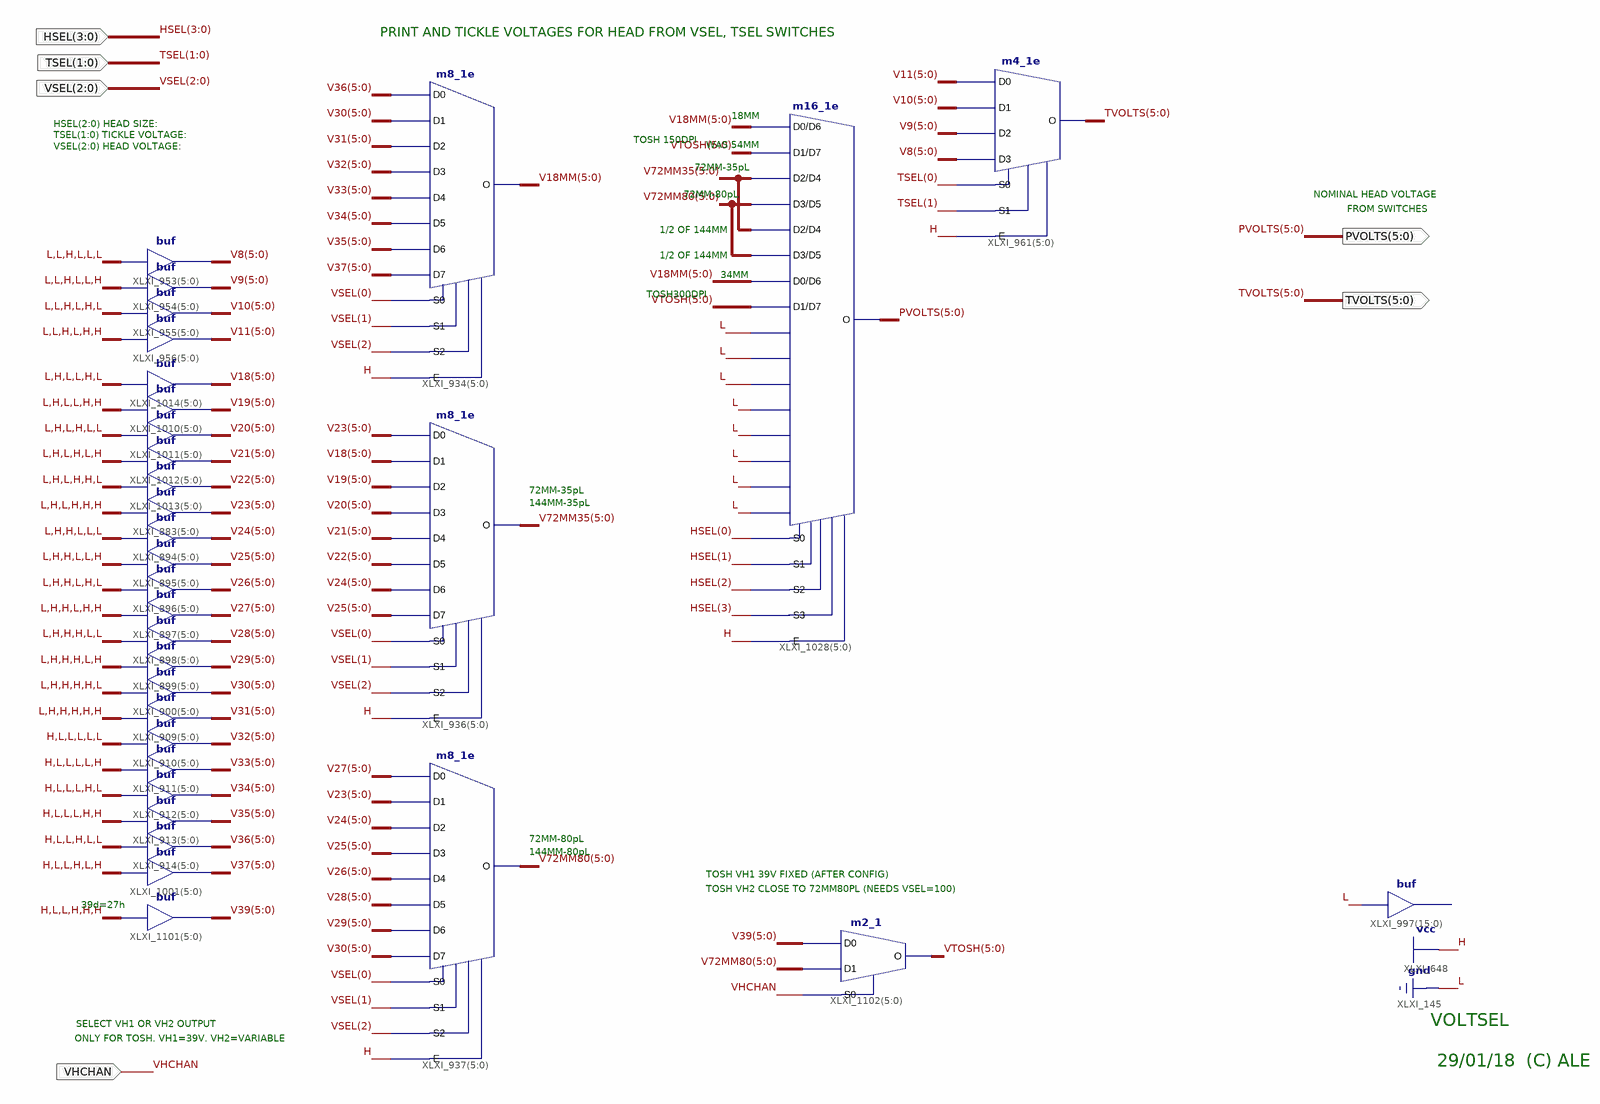
[diagram p0: schematic sheet 1]
// Xilinx ISE schematic DB_VoltSel.sch (spartan3e) as structural Verilog: 32 symbols, 6 ports
module DB_VoltSel (
  input  [3:0] HSEL,
  input  [2:0] VSEL,
  input  [1:0] TSEL,
  input  VHCHAN,
  output [5:0] TVOLTS,
  output [5:0] PVOLTS
);

  wire [5:0] V8, V9, V10, V11, V18, V18MM, V19, V20, V21, V22, V23, V24, V25, V26, V27, V28, V29, V30, V31,
       V32, V33, V34, V35, V36, V37, V39, V72MM35, V72MM80, VTOSH;

  // buf XLXI_997[15..0] has open pins: I=1'b0, O=open
  m8_1e XLXI_934[5:0] (
    .D0(V36), .D1(V30), .D2(V31), .D3(V32), .D4(V33), .D5(V34), .D6(V35), .D7(V37), .E(1'b1), .S0(VSEL[0]),
    .S1(VSEL[1]), .S2(VSEL[2]), .O(V18MM));
  m8_1e XLXI_936[5:0] (
    .D0(V23), .D1(V18), .D2(V19), .D3(V20), .D4(V21), .D5(V22), .D6(V24), .D7(V25), .E(1'b1), .S0(VSEL[0]),
    .S1(VSEL[1]), .S2(VSEL[2]), .O(V72MM35));
  m8_1e XLXI_937[5:0] (
    .D0(V27), .D1(V23), .D2(V24), .D3(V25), .D4(V26), .D5(V28), .D6(V29), .D7(V30), .E(1'b1), .S0(VSEL[0]),
    .S1(VSEL[1]), .S2(VSEL[2]), .O(V72MM80));
  m16_1e XLXI_1028[5:0] (
    .D0(V18MM), .D1(VTOSH), .D10(1'b0), .D11(1'b0), .D12(1'b0), .D13(1'b0), .D14(1'b0), .D15(1'b0),
    .D2(V72MM35), .D3(V72MM80), .D4(V72MM35), .D5(V72MM80), .D6(V18MM), .D7(VTOSH), .D8(1'b0), .D9(1'b0),
    .E(1'b1), .S0(HSEL[0]), .S1(HSEL[1]), .S2(HSEL[2]), .S3(HSEL[3]), .O(PVOLTS));
  m4_1e XLXI_961[5:0] (.D0(V11), .D1(V10), .D2(V9), .D3(V8), .E(1'b1), .S0(TSEL[0]), .S1(TSEL[1]), .O(TVOLTS));
  assign V23 = 6'b010111;  // buf XLXI_883[5..0], 6 bits wide
  assign V24 = 6'b011000;  // buf XLXI_894[5..0], 6 bits wide
  assign V25 = 6'b011001;  // buf XLXI_895[5..0], 6 bits wide
  assign V26 = 6'b011010;  // buf XLXI_896[5..0], 6 bits wide
  assign V27 = 6'b011011;  // buf XLXI_897[5..0], 6 bits wide
  assign V28 = 6'b011100;  // buf XLXI_898[5..0], 6 bits wide
  assign V29 = 6'b011101;  // buf XLXI_899[5..0], 6 bits wide
  assign V30 = 6'b011110;  // buf XLXI_900[5..0], 6 bits wide
  assign V31 = 6'b011111;  // buf XLXI_909[5..0], 6 bits wide
  assign V32 = 6'b100000;  // buf XLXI_910[5..0], 6 bits wide
  assign V33 = 6'b100001;  // buf XLXI_911[5..0], 6 bits wide
  assign V34 = 6'b100010;  // buf XLXI_912[5..0], 6 bits wide
  assign V35 = 6'b100011;  // buf XLXI_913[5..0], 6 bits wide
  assign V36 = 6'b100100;  // buf XLXI_914[5..0], 6 bits wide
  assign V37 = 6'b100101;  // buf XLXI_1001[5..0], 6 bits wide
  assign V19 = 6'b010011;  // buf XLXI_1010[5..0], 6 bits wide
  assign V20 = 6'b010100;  // buf XLXI_1011[5..0], 6 bits wide
  assign V21 = 6'b010101;  // buf XLXI_1012[5..0], 6 bits wide
  assign V22 = 6'b010110;  // buf XLXI_1013[5..0], 6 bits wide
  assign V18 = 6'b010010;  // buf XLXI_1014[5..0], 6 bits wide
  assign V8 = 6'b001000;  // buf XLXI_953[5..0], 6 bits wide
  assign V9 = 6'b001001;  // buf XLXI_954[5..0], 6 bits wide
  assign V10 = 6'b001010;  // buf XLXI_955[5..0], 6 bits wide
  assign V11 = 6'b001011;  // buf XLXI_956[5..0], 6 bits wide
  assign V39 = 6'b100111;  // buf XLXI_1101[5..0], 6 bits wide
  m2_1 XLXI_1102[5:0] (.D0(V39), .D1(V72MM80), .S0(VHCHAN), .O(VTOSH));

  // Notes on the sheet:
  //   PRINT AND TICKLE VOLTAGES FOR HEAD FROM VSEL, TSEL SWITCHES
  //   18MM
  //   HSEL(2:0) HEAD SIZE:
  //   TSEL(1:0) TICKLE VOLTAGE:
  //   TOSH 150DPI
  //   WAS 54MM
  //   VSEL(2:0) HEAD VOLTAGE:
  //   72MM-35pL
  //   72MM-80pL
  //   NOMINAL HEAD VOLTAGE
  //   FROM SWITCHES
  //   1/2 OF 144MM
  //   1/2 OF 144MM
  //   34MM
  //   TOSH300DPI
  //   72MM-35pL
  //   144MM-35pL
  //   72MM-80pL
  //   144MM-80pL
  //   TOSH VH1 39V FIXED (AFTER CONFIG)
  //   TOSH VH2 CLOSE TO 72MM80PL (NEEDS VSEL=100)
  //   39d=27h
  //   VOLTSEL
  //   SELECT VH1 OR VH2 OUTPUT
  //   ONLY FOR TOSH. VH1=39V. VH2=VARIABLE
  //   29/01/18  (C) ALE
endmodule
